# Altium schematic sheet HDMI.SchDoc: HDMI
size 431 x 279 mm; CheckedBy: Lance Bantoto; Engineer: Cindy Li; DocumentNumber: 15; Revision: 1; SheetNumber: 15; SheetTotal: 23
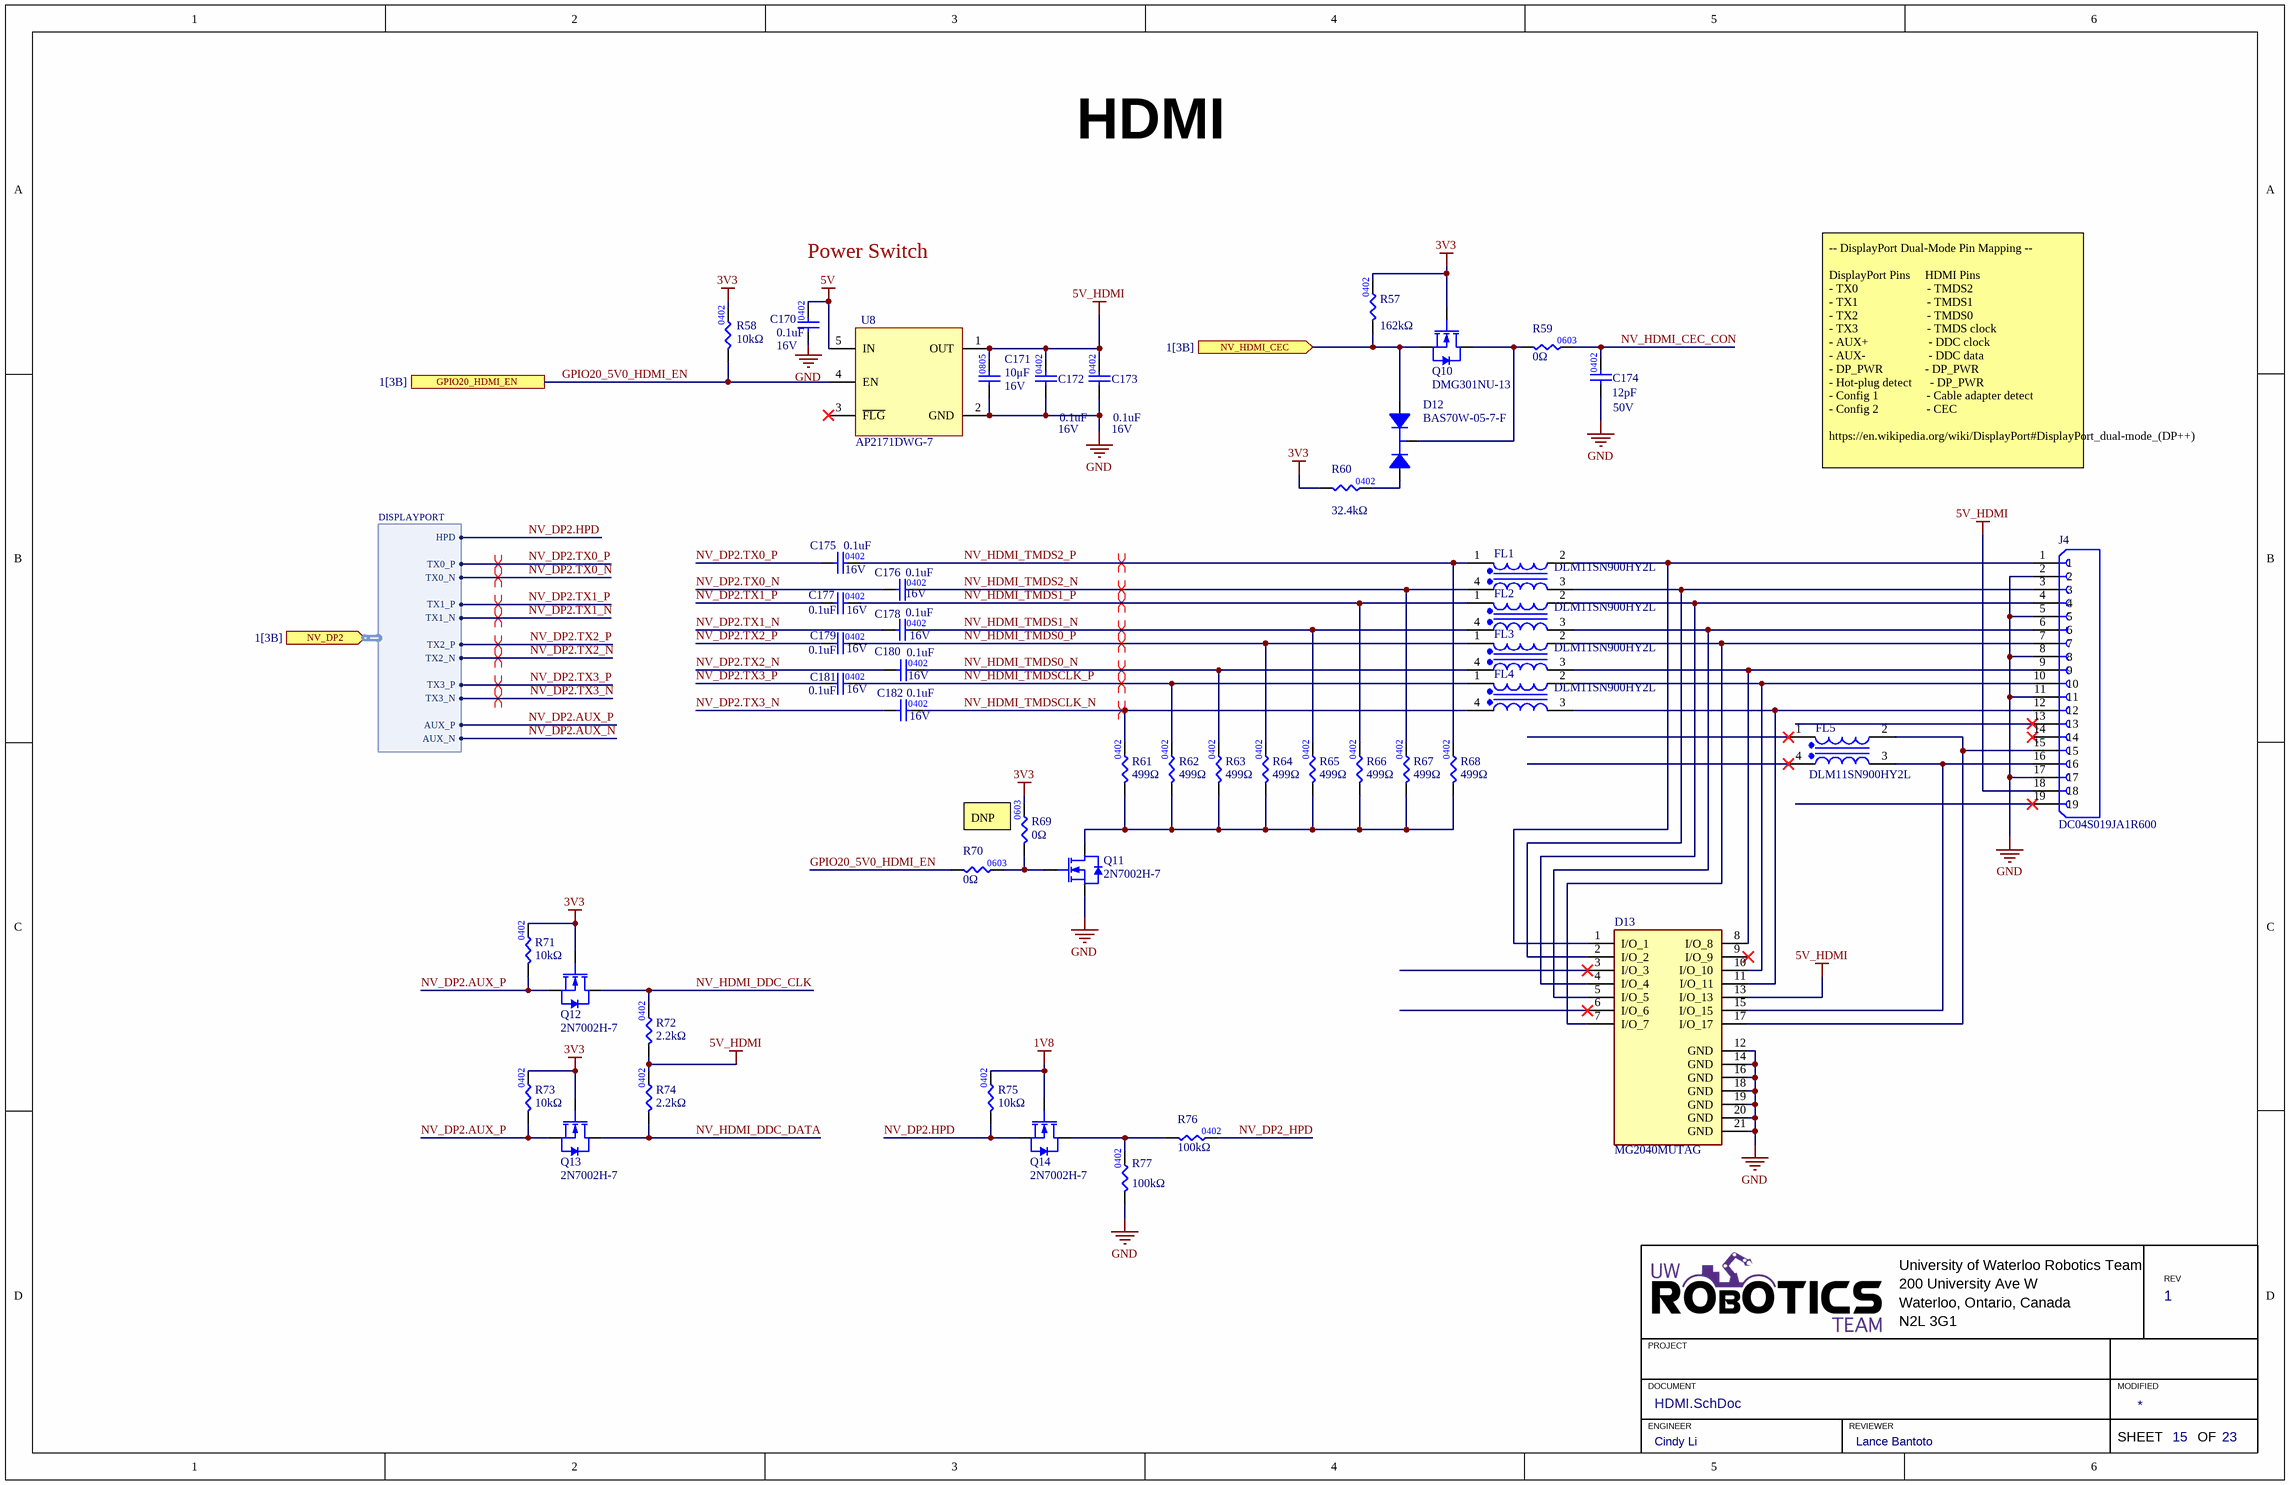
[diagram p0: HDMI.SchDoc]

## Parts
C170  Rated DC Voltage (URdc): 16V  Capacitance: 0.1uF  [CAP0402]  (hidden comment: CAP_0.1uF_16V_X7R_0402)
C171  value 10μF  Voltage Rating: 16V  [CAP2012]  (hidden comment: CAP_10uF_16V_0805)
C172  Rated DC Voltage (URdc): 16V  Capacitance: 0.1uF  [CAP0402]  (hidden comment: CAP_0.1uF_16V_X7R_0402)
C173  Rated DC Voltage (URdc): 16V  Capacitance: 0.1uF  [CAP0402]  (hidden comment: CAP_0.1uF_16V_X7R_0402)
C174  value 12pF  Voltage Rating: 50V  [CAP0402]  (hidden comment: CAP_12pF_50V_0402)
C175  Capacitance: 0.1uF  Rated DC Voltage (URdc): 16V  [CAP0402]  (hidden comment: CAP_0.1uF_16V_X7R_0402)
C176  Capacitance: 0.1uF  Rated DC Voltage (URdc): 16V  [CAP0402]  (hidden comment: CAP_0.1uF_16V_X7R_0402)
C177  Capacitance: 0.1uF  Rated DC Voltage (URdc): 16V  [CAP0402]  (hidden comment: CAP_0.1uF_16V_X7R_0402)
C178  Capacitance: 0.1uF  Rated DC Voltage (URdc): 16V  [CAP0402]  (hidden comment: CAP_0.1uF_16V_X7R_0402)
C179  Capacitance: 0.1uF  Rated DC Voltage (URdc): 16V  [CAP0402]  (hidden comment: CAP_0.1uF_16V_X7R_0402)
C180  Capacitance: 0.1uF  Rated DC Voltage (URdc): 16V  [CAP0402]  (hidden comment: CAP_0.1uF_16V_X7R_0402)
C181  Capacitance: 0.1uF  Rated DC Voltage (URdc): 16V  [CAP0402]  (hidden comment: CAP_0.1uF_16V_X7R_0402)
C182  Capacitance: 0.1uF  Rated DC Voltage (URdc): 16V  [CAP0402]  (hidden comment: CAP_0.1uF_16V_X7R_0402)
D12  BAS70W-05-7-F  [SOT323_BAS70W-05-7-F]
D13  MG2040MUTAG  [DIO_MG2040MUTAG]
FL1  DLM11SN900HY2L  [FIL_DLM11SN900HY2L]
FL2  DLM11SN900HY2L  [FIL_DLM11SN900HY2L]
FL3  DLM11SN900HY2L  [FIL_DLM11SN900HY2L]
FL4  DLM11SN900HY2L  [FIL_DLM11SN900HY2L]
FL5  DLM11SN900HY2L  [FIL_DLM11SN900HY2L]
J4  DC04S019JA1R600  [JAE_DC04S019JA1R600]
Q10  DMG301NU-13  [SOT23-3]
Q11  2N7002H-7  [SOT23-3]
Q12  2N7002H-7  [SOT23-3]
Q13  2N7002H-7  [SOT23-3]
Q14  2N7002H-7  [SOT23-3]
R57  value 162kΩ  [RES0402]  (hidden comment: RES_162kΩ_0402_1%)
R58  value 10kΩ  [RES0402]  (hidden comment: RES_10kΩ_0402_1%)
R59  value 0Ω  [RES0603]  (hidden comment: RES_0Ω_0603)
R60  value 32.4kΩ  [RES0402]  (hidden comment: RES_32.4kΩ_0402_1%)
R61  value 499Ω  [RES0402]  (hidden comment: RES_499Ω_0402_1%)
R62  value 499Ω  [RES0402]  (hidden comment: RES_499Ω_0402_1%)
R63  value 499Ω  [RES0402]  (hidden comment: RES_499Ω_0402_1%)
R64  value 499Ω  [RES0402]  (hidden comment: RES_499Ω_0402_1%)
R65  value 499Ω  [RES0402]  (hidden comment: RES_499Ω_0402_1%)
R66  value 499Ω  [RES0402]  (hidden comment: RES_499Ω_0402_1%)
R67  value 499Ω  [RES0402]  (hidden comment: RES_499Ω_0402_1%)
R68  value 499Ω  [RES0402]  (hidden comment: RES_499Ω_0402_1%)
R69  value 0Ω  [RES0603]  (hidden comment: RES_0Ω_0603)
R70  value 0Ω  [RES0603]  (hidden comment: RES_0Ω_0603)
R71  value 10kΩ  [RES0402]  (hidden comment: RES_10kΩ_0402_1%)
R72  value 2.2kΩ  [RES0402]  (hidden comment: RES_2.2kΩ_0402_5%)
R73  value 10kΩ  [RES0402]  (hidden comment: RES_10kΩ_0402_1%)
R74  value 2.2kΩ  [RES0402]  (hidden comment: RES_2.2kΩ_0402_5%)
R75  value 10kΩ  [RES0402]  (hidden comment: RES_10kΩ_0402_1%)
R76  value 100kΩ  [RES0402]  (hidden comment: RES_100kΩ_0402_5%)
R77  value 100kΩ  [RES0402]  (hidden comment: RES_100kΩ_0402_5%)
U8  AP2171DWG-7  [AP2171DWG-7]

## Ports
GPIO20_HDMI_EN (see 1[3B]), NV_DP2 (in, harness DISPLAYPORT, see 1[3B]), NV_HDMI_CEC (in, see 1[3B])

## Harnesses
DISPLAYPORT: HPD, TX0_P, TX0_N, TX1_P, TX1_N, TX2_P, TX2_N, TX3_P, TX3_N, AUX_P, AUX_N

## Nets
1V8: Q14.1(GATE) R75.2
3V3: Q10.1(GATE) Q12.1(GATE) Q13.1(GATE) R57.2 R58.2 R60.1 R69.2 R71.2 R73.2
5V: C170.2 U8.5(IN)
5V_HDMI: C171.2 C172.2 C173.2 D13.13(I/O_13) J4.18 R72.1 R74.2 U8.1(OUT)
GND: C170.1 C171.1 C172.1 C173.1 C174.1 D13.12(GND) D13.14(GND) D13.16(GND) D13.18(GND) D13.19(GND) D13.20(GND) D13.21(GND) J4.2 J4.5 J4.8 J4.11 J4.17 Q11.2(SOURCE) R77.1 U8.2(GND)
GPIO20_5V0_HDMI_EN: R58.1 R70.1 U8.4(EN) ; port GPIO20_HDMI_EN
NV_DP2.AUX_N: port NV_DP2.AUX_N
NV_DP2.AUX_P: Q12.2(SOURCE) Q13.2(SOURCE) R71.1 R73.1 ; port NV_DP2.AUX_P
NV_DP2.HPD: Q14.2(SOURCE) R75.1 ; port NV_DP2.HPD
NV_DP2.TX0_N: C176.1 ; port NV_DP2.TX0_N
NV_DP2.TX0_P: C175.1 ; port NV_DP2.TX0_P
NV_DP2.TX1_N: C178.1 ; port NV_DP2.TX1_N
NV_DP2.TX1_P: C177.1 ; port NV_DP2.TX1_P
NV_DP2.TX2_N: C180.1 ; port NV_DP2.TX2_N
NV_DP2.TX2_P: C179.1 ; port NV_DP2.TX2_P
NV_DP2.TX3_N: C182.1 ; port NV_DP2.TX3_N
NV_DP2.TX3_P: C181.1 ; port NV_DP2.TX3_P
NV_DP2_HPD: R76.2
NV_HDMI_CEC: D12.2 Q10.2(SOURCE) R57.1 ; port NV_HDMI_CEC
NV_HDMI_CEC_CON: C174.2 R59.2
NV_HDMI_DDC_CLK: Q12.3(DRAIN) R72.2
NV_HDMI_DDC_DATA: Q13.3(DRAIN) R74.1
NV_HDMI_TMDS0_N: C180.2 FL3.4 R63.2
NV_HDMI_TMDS0_P: C179.2 FL3.1 R64.2
NV_HDMI_TMDS1_N: C178.2 FL2.4 R65.2
NV_HDMI_TMDS1_P: C177.2 FL2.1 R66.2
NV_HDMI_TMDS2_N: C176.2 FL1.4 R67.2
NV_HDMI_TMDS2_P: C175.2 FL1.1 R68.2
NV_HDMI_TMDSCLK_N: C182.2 FL4.4 R61.2
NV_HDMI_TMDSCLK_P: C181.2 FL4.1 R62.2
NetD12_1: D12.1 R60.2
NetD12_3: D12.3 Q10.3(DRAIN) R59.1
NetD13_1: D13.1(I/O_1) FL1.2 J4.1
NetD13_2: D13.2(I/O_2) FL1.3 J4.3
NetD13_4: D13.4(I/O_4) FL2.2 J4.4
NetD13_5: D13.5(I/O_5) FL2.3 J4.6
NetD13_7: D13.7(I/O_7) FL3.2 J4.7
NetD13_8: D13.8(I/O_8) FL3.3 J4.9
NetD13_10: D13.10(I/O_10) FL4.2 J4.10
NetD13_11: D13.11(I/O_11) FL4.3 J4.12
NetD13_15: D13.15(I/O_15) FL5.3 J4.16
NetD13_17: D13.17(I/O_17) FL5.2 J4.15
NetQ11_1: Q11.1(GATE) R69.1 R70.2
NetQ11_3: Q11.3(DRAIN) R61.1 R62.1 R63.1 R64.1 R65.1 R66.1 R67.1 R68.1
NetQ14_3: Q14.3(DRAIN) R76.1 R77.2

Not connected (* = marked no-connect by the designer): D13 3(I/O_3)* 6(I/O_6)* 9(I/O_9)*; FL5 1* 4*; J4 13* 14* 19*; U8 3(~{FLG})*

## Layout directives
differential pair: NV_DP2.TX0_N, NV_DP2.TX0_P, NV_DP2.TX1_N, NV_DP2.TX1_P, NV_DP2.TX2_N, NV_DP2.TX2_P, NV_DP2.TX3_N, NV_DP2.TX3_P, NV_HDMI_TMDS0_N, NV_HDMI_TMDS0_P, NV_HDMI_TMDS1_N, NV_HDMI_TMDS1_P, NV_HDMI_TMDS2_N, NV_HDMI_TMDS2_P, NV_HDMI_TMDSCLK_N, NV_HDMI_TMDSCLK_P

## Notes on the sheet
- Power Switch
- -- DisplayPort Dual-Mode Pin Mapping --
  DisplayPort Pins     HDMI Pins
  - TX0                       - TMDS2
  - TX1                       - TMDS1
  - TX2                       - TMDS0
  - TX3                       - TMDS clock
  - AUX+                    - DDC clock
  - AUX-                     - DDC data
  - DP_PWR              - DP_PWR
  - Hot-plug detect      - DP_PWR
  - Config 1                - Cable adapter detect
  - Config 2                - CEC
  https://en.wikipedia.org/wiki/DisplayPort#DisplayPort_dual-mode_(DP++)
- (near R69) DNP
- University of Waterloo Robotics Team
- 200 University Ave W
- REV
- PROJECT
- Waterloo, Ontario, Canada
- N2L 3G1
- DOCUMENT
- ENGINEER
- REVIEWER
- MODIFIED
- SHEET
- OF

## Library data of the parts
C170 C172 C173 C175-C182 = CAP_0.1uF_16V_X7R_0402: Ceramic Capacitor, Ceramic; Manufacturer: Taiyo Yuden; Manufacturer Part Number: LMK212AC6106MD-T; Multilayer: Yes; Negative Tolerance: 10%; Temperature Characteristics Code: X7R; Supplier Part Number 1: 587-6337-1-ND; Supplier 1: Digi-Key; RoHS: Yes; Stock 1: 703; Pricing 1: 1=0.29000, 10=0.20100, 50=0.12060, 100=0.10180, 500=0.06966, 1000=0.06163 (USD); ComponentLink1URL: https://datasheet.ciiva.com:443/pdfs/VipMasterIC/IC/TAIY/TAIY-S-A0009099504/TAIY-S-A0009099407-1.pdf?src-supplier=IHS+Markit; ComponentLink1Description: https://datasheet.ciiva.com:443/pdfs/VipMasterIC/IC/TAIY/TAIY-S-A0009099504/TAIY-S-A0009099407-1.pdf?src-supplier=IHS+Markit; ComponentLink2URL: https://ds.yuden.co.jp/TYCOMPAS/ut/detail?pn=LMK212AC6106MD-T &amp;u=M&src-supplier=Digi-Key; ComponentLink2Description: https://ds.yuden.co.jp/TYCOMPAS/ut/detail?pn=LMK212AC6106MD-T &amp;u=M&src-supplier=Digi-Key; Supplier 2: Digi-Key; Supplier Part Number 2: 1292-1630-1-ND; Category: Ceramic Capacitors; Stock 2: 20327886; Pricing 2: 1=0.10000, 10=0.02800, 50=0.01500, 100=0.01220, 500=0.00876, 1000=0.00688, 2500=0.00625, 5000=0.00575 (USD); Mount: Surface Mount; Number of Pins: 2; Dielectric Material: Ceramic; Package Shape: Rectangular; Terminal Finish: Nickel; Min Operating Temperature: -55°C; Max Operating Temperature: 125°C; JESD-609 Code: e3; Capacitor Type: Ceramic; Package Style: SMTMeter; Packaging: Tape and Reel; Positive Tolerance: 10%; Termination: Wraparound; Length: 1mm; Width: 0.5mm; Height: 0.5mm; REACH SVHC: Yes; RoHS Compliant: Yes; ComponentLink3URL: https://datasheet.ciiva.com:443/pdfs/VipMasterIC/IC/WATC/WATC-S-A0009550342/WATC-S-A0009550342-1.pdf?src-supplier=IHS+Markit; ComponentLink3Description: https://datasheet.ciiva.com:443/pdfs/VipMasterIC/IC/WATC/WATC-S-A0009550342/WATC-S-A0009550342-1.pdf?src-supplier=IHS+Markit; ComponentLink4URL: http://www.farnell.com/datasheets/2340522.pdf?src-supplier=Farnell; ComponentLink4Description: http://www.farnell.com/datasheets/2340522.pdf?src-supplier=Farnell; ComponentLink5URL: http://components.arrow.com/part/dataview/0323_00654690?src-supplier=Arrow+Europe; ComponentLink5Description: http://components.arrow.com/part/dataview/0323_00654690?src-supplier=Arrow+Europe; ComponentLink6URL: https://www.verical.com/server-webapp/html/getDatasheet?partID=415228&src-supplier=Verical; ComponentLink6Description: https://www.verical.com/server-webapp/html/getDatasheet?partID=415228&src-supplier=Verical; ComponentLink7URL: http://www.passivecomponent.com/indexsea/0402B104K160CT-IN.pdf?src-supplier=Digi-Key; ComponentLink7Description: http://www.passivecomponent.com/indexsea/0402B104K160CT-IN.pdf?src-supplier=Digi-Key; ComponentLink8URL: http://www.passivecomponent.com/wp-content/uploads/2018/10/MLCC.pdf?src-supplier=Digi-Key; ComponentLink8Description: http://www.passivecomponent.com/wp-content/uploads/2018/10/MLCC.pdf?src-supplier=Digi-Key; ComponentLink9URL: http://www.farnell.com/datasheets/2340522.pdf?src-supplier=Element14; ComponentLink9Description: http://www.farnell.com/datasheets/2340522.pdf?src-supplier=Element14; ComponentLink10URL: http://www.farnell.com/datasheets/2340522.pdf?src-supplier=Newark; ComponentLink10Description: http://www.farnell.com/datasheets/2340522.pdf?src-supplier=Newark; Size Code: 0402; Supplier 3: Digi-Key; Supplier Part Number 3: 445-173645-1-ND; Stock 3: 3627; Pricing 3: 1=0.20000, 10=0.14200, 50=0.08080, 100=0.06700, 500=0.04696, 1000=0.03888, 2500=0.03619, 5000=0.03311 (USD); ComponentLink11URL: https://datasheet.ciiva.com:443/pdfs/VipMasterIC/IC/TDKC/TDKC-S-A0007785269/TDKC-S-A0007785269-1.pdf?src-supplier=IHS+Markit; ComponentLink11Description: https://datasheet.ciiva.com:443/pdfs/VipMasterIC/IC/TDKC/TDKC-S-A0007785269/TDKC-S-A0007785269-1.pdf?src-supplier=IHS+Markit; ComponentLink12URL: https://product.tdk.com/info/en/catalog/spec/mlccspec_commercial_soft_en.pdf?src-supplier=Digi-Key; ComponentLink12Description: https://product.tdk.com/info/en/catalog/spec/mlccspec_commercial_soft_en.pdf?src-supplier=Digi-Key
C171 = CAP_10uF_16V_0805: CAP CER 10UF 16V X5R 0805; Manufacturer 1: Yageo; Manufacturer Part Number 1: CC0805KKX5R7BB106; Package/Footprint: 0805; Supplier Part Number 1: 311-1865-1-ND; Supplier 1: Digi-Key; Mounting Type: SMD; Dielectric: X5R
C174 = CAP_12pF_50V_0402: CAP CER 12PF 50V C0G 0402; Manufacturer Part Number 1: CC0603KRX7R9BB104; Manufacturer 1: TDK Corporation; Package/Footprint: 0402; Dielectric: C0G, NP0; Tolerance: ±5%; Supplier Part Number 1: 445-5585-1-ND; Supplier 1: Digi-Key; Mounting Type: SMD
D12 = BAS70W-05-7-F: DIODE ARRAY SCHOTTKY 70V SOT323; Manufacturer 1: Diodes Incorporated; Diode Configuration: 1 Pair Common Cathode; Current - Average Rectified (Io) (per diode): 70mA; Voltage - Forward (Vf) (Max) @ If: 1V @ 15mA; Current - Reverse Leakage @ Vr: 100nA @ 50V; Manufacturer Part Number 1: BAS70W-05-7-F; Supplier 1: Digi-Key; Supplier Part Number 1: BAS70W-05FDICT-ND; Diode Type: Schottky; Package: SOT-323; Voltage - DC Reverse (Vr) (Max): 70V
D13 = MG2040MUTAG: 10V Clamp 1A (8/20µs) Ipp Tvs Diode Surface Mount 18-UDFN (5.5x1.5); Manufacturer 1: ON Semiconductor; Manufacturer Part Number 1: MG2040MUTAG; Supplier 1: Digi-Key; Supplier Part Number 1: MG2040MUTAGCT-ND; Package: 18-UFDFN
FL1-FL5 = DLM11SN900HY2L: 2 Line Common Mode Choke Surface Mount 90 Ohms @ 100 MHz 100mA DCR 1.38Ohm; Manufacturer 1: Murata Electronics; Voltage Rating - DC: 5V; Manfuacturer Part Number 1: DLM11SN900HY2L; Supplier 1: Digi-Key; Supplier Part Number 1: 490-11941-1-ND; Current Rating (Max): 100mA; DC Resistance (DCR) (Max): 1.38Ohm; Package: 0504
J4 = DC04S019JA1R600: HDMI HDMI 2.1 Receptacle Connector 19 Position Surface Mount, Right Angle; Through Hole; Manufacturer 1: JAE Electronics; Current Rating: 0.5A; Manufacturer Part Number 1: DC04S019JA1R600; Supplier 1: Digi-Key; Supplier Part Number 1: 670-3154-1-ND; Specifications: HDMI 2.1; Mounting Type: Surface Mount, Right Angle; Through Hole
Q10 = DMG301NU-13: MOSFET N-CH 25V 260MA SOT23; Manufacturer 1: Diodes Incorporated; Package/Footprint: SOT-23; Id: 260mA (Ta); Vgs (Max): ±8V; Supplier 1: Digi-Key; Mounting Type: SMD; Supplier Part Number 1: DMG301NU-13DICT-ND; Vdss: 25V; Verified: No; Manufacturer Part Number 1: DMG301NU-13
Q11-Q14 = 2N7002H-7: MOSFET N-CH 60V 170MA SOT23; Manufacturer 1: Diodes Incorporated; Package/Footprint: SOT-23; Vgs (Max): ±20V; Supplier 1: Digi-Key; Mounting Type: SMD; Supplier Part Number 1: 2N7002H-7DICT-ND; Id: 170mA; Vdss: 60V; Verified: No; Manufacturer Part Number 1: 2N7002H-7
R57 = RES_162kΩ_0402_1%: RES 162K OHM 1% 1/16W 0402; Manufacturer Part Number 1: RMCF0402FT162K; Manufacturer 1: Panasonic Electronic Components; Power: 0.063W, 1/16W; Package/Footprint: 0402; Supplier 1: Digi-Key; Supplier Part Number 1: RMCF0402FT162KCT-ND; Mounting Type: SMD; Tolerance: 1%
R58 R71 R73 R75 = RES_10kΩ_0402_1%: RES SMD 10K OHM 1% 1/16W 0402; Manufacturer Part Number 1: CRCW040210K0FKTD; Manufacturer 1: Vishay Dale; Power: 0.063W, 1/16W; Package/Footprint: 0402; Supplier 1: Digi-Key; Supplier Part Number 1: 541-2955-1-ND; Mounting Type: SMD; Tolerance: 1%
R59 R69 R70 = RES_0Ω_0603: RES 0 OHM JUMPER 1/10W 0603; Manufacturer 1: Yageo; Manufacturer Part Number 1: RC0603JR-070RL; Package/Footprint: 0603; Supplier Part Number 1: 311-0.0GRCT-ND; Supplier 1: Digi-Key; Mounting Type: SMD
R60 = RES_32.4kΩ_0402_1%: RES SMD 32.4K OHM 1% 1/10W 0402; Manufacturer Part Number 1: ERJ-2RKF3242X; Manufacturer 1: Panasonic Electronic Components; Power: 0.1W, 1/10W; Package/Footprint: 0402; Supplier 1: Digi-Key; Supplier Part Number 1: P32.4KLCT-ND; Mounting Type: SMD; Tolerance: 1%
R61-R68 = RES_499Ω_0402_1%: RES 499 OHM 1% 1/16W 0402; Manufacturer Part Number 1: RMCF0402FT499R; Manufacturer 1: Stackpole Electronics Inc; Package/Footprint: 0402; Power: 0.063W, 1/16W; Supplier 1: Digi-Key; Supplier Part Number 1: RMCF0402FT499RCT-ND; Mounting Type: SMD; Tolerance: 1%
R72 R74 = RES_2.2kΩ_0402_5%: RES SMD 2.2K OHM 5% 1/10W 0402; Manufacturer 1: Panasonic Electronic Components; Manufacturer Part Number 1: ERJ-2GEJ222X; Package/Footprint: 0402; Supplier Part Number 1: P2.2KJCT-ND; Supplier 1: Digi-Key; Mounting Type: SMD
R76 R77 = RES_100kΩ_0402_5%: RES SMD 100K OHM 5% 1/10W 0402; Manufacturer Part Number 1: ERJ-2GEJ104X; Manufacturer 1: Panasonic Electronic Components; Power: 0.1W, 1/10W; Package/Footprint: 0402; Supplier 1: Digi-Key; Supplier Part Number 1: P100KJCT-ND; Mounting Type: SMD; Tolerance: 5%
U8 = AP2171DWG-7: Power Switch/Driver 1:1 P-Channel 1A SOT-25; Manufacturer 1: Diodes Incorporated; Rds On (Typ): 95mOhm; Voltage - Load: 2.7V - 5.5V; Supplier 1: Digi-Key; Supplier Part Number 1: AP2171DWG-7DICT-ND; Manufacturer Part Number 1: AP2171DWG-7; Current - Output (Max): 1A; Package: SOT-25